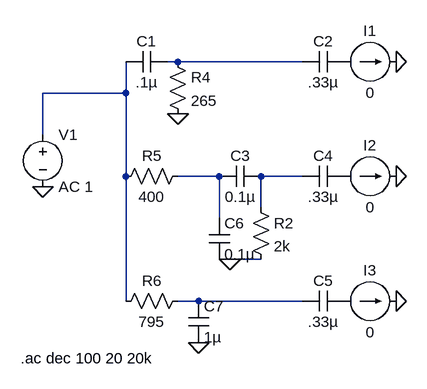
[diagram p0: schematic lab 6.asc]
lab 6.asc, the LTspice schematic file:
Version 4
SHEET 1 880 680
WIRE 96 16 80 16
WIRE 288 16 96 16
WIRE 16 64 16 16
WIRE 16 64 -112 64
WIRE -112 128 -112 64
WIRE 16 192 16 64
WIRE 160 192 96 192
WIRE 288 192 224 192
WIRE 224 240 224 192
WIRE 160 256 160 192
WIRE 176 320 160 320
WIRE 224 320 176 320
WIRE 16 384 16 192
WIRE 128 384 96 384
WIRE 288 384 128 384
FLAG 96 96 0
FLAG 128 448 0
FLAG 176 320 0
FLAG -112 208 0
FLAG 432 192 0
FLAG 432 384 0
FLAG 432 16 0
SYMBOL voltage -112 112 R0
WINDOW 123 0 0 Left 2
WINDOW 39 0 0 Left 2
SYMATTR InstName V1
SYMATTR Value AC 1
SYMBOL cap 16 0 M90
WINDOW 0 0 32 VBottom 2
WINDOW 3 32 32 VTop 2
SYMATTR InstName C1
SYMATTR Value .1µ
SYMBOL cap 288 0 M90
WINDOW 0 0 32 VBottom 2
WINDOW 3 32 32 VTop 2
SYMATTR InstName C2
SYMATTR Value .33µ
SYMBOL cap 160 176 M90
WINDOW 0 0 32 VBottom 2
WINDOW 3 32 32 VTop 2
SYMATTR InstName C3
SYMATTR Value 0.1µ
SYMBOL cap 288 176 M90
WINDOW 0 0 32 VBottom 2
WINDOW 3 32 32 VTop 2
SYMATTR InstName C4
SYMATTR Value .33µ
SYMBOL cap 288 368 M90
WINDOW 0 0 32 VBottom 2
WINDOW 3 32 32 VTop 2
SYMATTR InstName C5
SYMATTR Value .33µ
SYMBOL cap 144 320 M180
WINDOW 0 24 56 Left 2
WINDOW 3 24 8 Left 2
SYMATTR InstName C6
SYMATTR Value 0.1µ
SYMBOL cap 112 448 M180
WINDOW 0 24 56 Left 2
WINDOW 3 24 8 Left 2
SYMATTR InstName C7
SYMATTR Value 1µ
SYMBOL res 208 224 R0
SYMATTR InstName R2
SYMATTR Value 2k
SYMBOL res 80 0 R0
SYMATTR InstName R4
SYMATTR Value 265
SYMBOL res 112 176 R90
WINDOW 0 0 56 VBottom 2
WINDOW 3 32 56 VTop 2
SYMATTR InstName R5
SYMATTR Value 400
SYMBOL res 112 368 R90
WINDOW 0 0 56 VBottom 2
WINDOW 3 32 56 VTop 2
SYMATTR InstName R6
SYMATTR Value 795
SYMBOL current 352 16 R270
WINDOW 0 32 40 VTop 2
WINDOW 3 -32 40 VBottom 2
WINDOW 123 0 0 Left 2
WINDOW 39 0 0 Left 2
SYMATTR InstName I1
SYMATTR Value 0
SYMBOL current 352 192 R270
WINDOW 0 32 40 VTop 2
WINDOW 3 -32 40 VBottom 2
WINDOW 123 0 0 Left 2
WINDOW 39 0 0 Left 2
SYMATTR InstName I2
SYMATTR Value 0
SYMBOL current 352 384 R270
WINDOW 0 32 40 VTop 2
WINDOW 3 -32 40 VBottom 2
WINDOW 123 0 0 Left 2
WINDOW 39 0 0 Left 2
SYMATTR InstName I3
SYMATTR Value 0
TEXT -146 472 Left 2 !.ac dec 100 20 20k

The netlist it stands for:
* lab 6.asc
V1 N002 0 AC 1
C1 N002 N001 .1µ
C2 N001 P001 .33µ
C3 N003 N004 0.1µ
C4 N004 P002 .33µ
C5 N005 P003 .33µ
C6 0 N003 0.1µ
C7 0 N005 1µ
R2 N004 0 2k
R4 N001 0 265
R5 N003 N002 400
R6 N005 N002 795
I1 P001 0 0
I2 P002 0 0
I3 P003 0 0
.ac dec 100 20 20k
.backanno
.end